# Altium schematic sheet SDC.SchDoc
size A4; DrawnBy: Arvin Dev; SheetNumber: 1; SheetTotal: 1
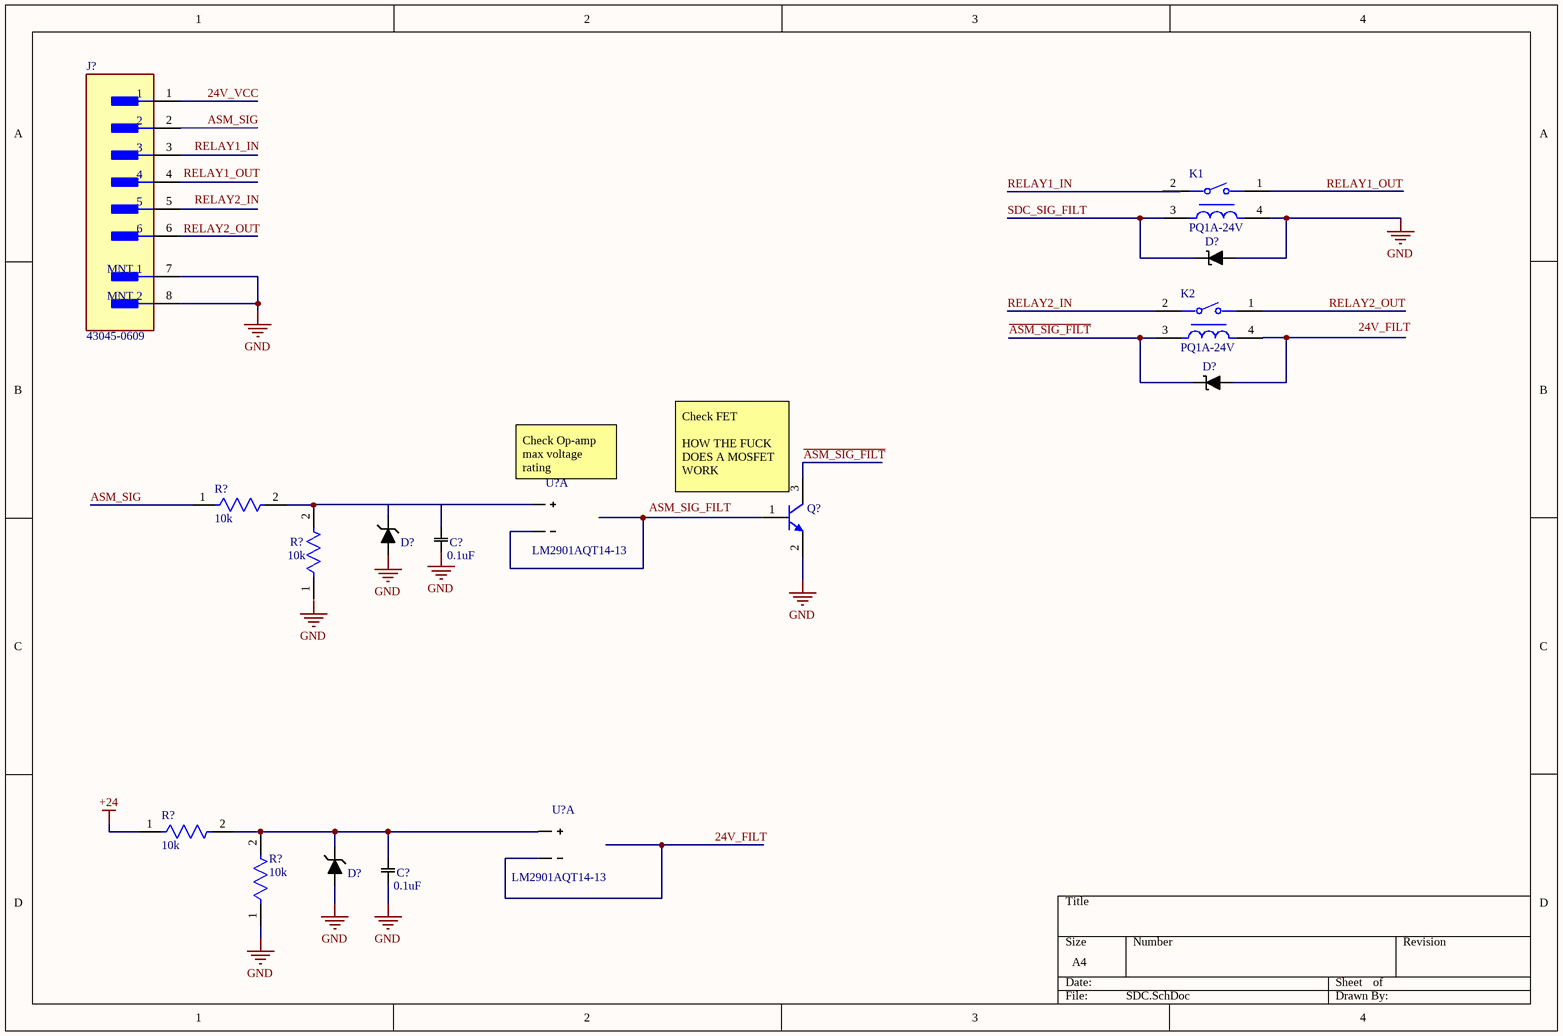
[diagram p0: SDC.SchDoc]

## Parts
(Parts that share a designator on the sheet are numbered #1, #2 ... from top to bottom, then left to right.)
C?#1  value 0.1uF  [CAPC1608X09M]  (hidden comment: CL10B104KB8NNWC)
C?#2  value 0.1uF  [CAPC1608X09M]  (hidden comment: CL10B104KB8NNWC)
D?#1  BAT54LT1G  [SOT95P237X111-3N]  (value not drawn)
D?#2  BAT54LT1G  [SOT95P237X111-3N]  (value not drawn)
D?#3  PZS1116BES_R1_00001  [SODFL160X65-2N]  (value not drawn)
D?#4  PZS1116BES_R1_00001  [SODFL160X65-2N]  (value not drawn)
J?  43045-0609  [FP-43045-0609-MFG]
K1  PQ1A-24V  [FP-PQ1A-24V-MFG]
K2  PQ1A-24V  [FP-PQ1A-24V-MFG]
Q?  BC847B  [INF-SOT23_M]  (value not drawn)
R?#1  10k  [FP-ESR03-MFG]
R?#2  10k  [FP-ESR03-MFG]
R?#3  10k  [FP-ESR03-MFG]
R?#4  10k  [FP-ESR03-MFG]
U?#1  LM2901AQT14-13  [TSOP65P640X120-14N]  (part A of 5)
U?#2  LM2901AQT14-13  [TSOP65P640X120-14N]  (part A of 5)

## Nets
+24: R?#3.1
GND: C?#1.2 C?#2.2 D?#1.1(A) D?#3.2(A) D?#4.2(A) J?.7(MNT_1) J?.8(MNT_2) K1.4 Q?.2(E) R?#4.1
24V_FILT: U?#2.1(OUT1) U?#2.6(IN1-)
24V_VCC: J?.1
~{ASM_SIG_FILT}: D?#2.3(K) K2.3 Q?.3(C)
ASM_SIG: J?.2 R?#1.1
RELAY1_IN: K1.2(COM)
RELAY1_OUT: K1.1(NO)
RELAY2_IN: K2.2(COM)
RELAY2_OUT: J?.6 K2.1(NO)
SDC_SIG_FILT: D?#1.3(K) K1.3
NetC?#1_1: C?#1.1 D?#3.1(K) R?#1.2 R?#2.2 U?#1.7(IN1+)
NetC?#2_1: C?#2.1 D?#4.1(K) R?#3.2 R?#4.2 U?#2.7(IN1+)
NetD?#2_1: D?#2.1(A) K2.4
NetQ?_1: Q?.1(B) U?#1.1(OUT1) U?#1.6(IN1-)

Not connected (* = marked no-connect by the designer): J? 3 4 5; R?#2 1

## Notes on the sheet
- (near U?#1) Check Op-amp max voltage rating
- (near Q?) Check FET
  HOW THE FUCK DOES A MOSFET WORK
- Labels drawn without touching a wire or pin: 24V_FILT, ASM_SIG_FILT, GND, RELAY1_IN, RELAY1_OUT, RELAY2_IN

## Library data of the parts
C?#1 C?#2 = CMP-001-00001-2: CAP CER 0.1UF 50V X7R 0603; Manufacturer: Samsung Electro-Mechanics; SPN: 1276-1935-1-ND; MPN: CL10B104KB8NNWC; Link: https://www.digikey.com.au/en/products/detail/samsung-electro-mechanics/CL10B104KB8NNWC/3887593; Supplier: Digi-Key
D?#1 D?#2 = CMP-00025-2: DIODE SCHOTTKY 30V 200MA SOT23-3; Manufacturer: onsemi; SPN: BAT54LT1GOSCT-ND; Link: https://www.digikey.com.au/en/products/detail/onsemi/BAT54LT1G/918316; Supplier: Digi-Key; MPN: BAT54LT1G
D?#3 D?#4 = CMP-004-00000-1: Zener Diode 16 V 150 mW ±5% Surface Mount SOD-523; Manufacturer: Panjit International Inc.; SPN: 3757-PZS1116BES_R1_00001CT-ND; Link: https://www.digikey.com.au/en/products/detail/panjit-international-inc/PZS1116BES-R1-00001/15800333; MPN: PZS1116BES_R1_00001; Supplier: Digi-Key
J? = CMP-00066-1: Header, 2 Row, Right-Angle, Solder Tab, 6 Pin, Tin Plate, SMT, Glow Wire Compatible; Current Rating: 5A; Glow Wire Compliant: Compliant; Mating Cycles: 30; Pitch: 3mm; Voltage Rating (AC): 250V; Voltage Rating: 600V; Contact Resistance: 10mR; Row Spacing: 0.118inch; Max Voltage Rating (DC): 250.25kV; Gender: Male; Connector Type: Power,Rectangular; Insulation Resistance: 1GR; Number of Circuits: 6; Color: Black; Material: Polymer,Glass,Thermoplastic; Contact Material: Brass,Tin; Fastening Type: Ramp; Contact Gender: Male; Packaging: Tape and Reel; Termination: Solder; Contact Plating: Tin; Min Operating Temperature: -40°C; Halogen Free: Low Halogen; Diameter: 3mm; Reach SVHC Compliant: Unknown; Contact Type: Male Pin; Housing Color: Black; Housing Material: Thermoplastic; RoHS Compliant: Yes; Max Operating Temperature: 105°C; Orientation: Right Angle; Number of Rows: 2; Mounting Technology: Surface Mount,PCB; Flammability Rating: UL94 V-0; Number of Poles: 6; Lead Free: Lead Free; Package Quantity: 10; Number of Positions: 6; Working Voltage: 250V; Number of Contacts: 6; Series: Micro-Fit 3.0™ 43045; Voltage Rating (DC): 250V
K1 K2 = CMP-05606-000034-1: RELAY GEN PURPOSE SPST 5A 24V; Max Voltage Rating (DC): 110V; Max Voltage Rating (AC): 250V; Coil Power: 200mW; Release Time: 10ms; Relay Type: General Purpose; Coil Current: 8.3mA; Coil Resistance: 2.88kR; Coil Type: Non-Latching; Operate Time: 20ms; Contact Material: Silver; Length: 20mm; Voltage Rating (AC): 250V; Number of Pins: 4; RoHS Compliant: Yes; Min Operating Temperature: -40°C; Throw Configuration: SPST; Power Consumption: 200mW; Lead Free: Lead Free; Depth: 10mm; Contact Current Rating: 5A; Package Quantity: 100; Weight: 7g; Mount: Through Hole; Type: Mechanical; Packaging: Bulk; Termination: PC Pin; Radiation Hardening: No; Series: PQ; Max Operating Temperature: 70°C; Max Current Rating: 5A; Coil Voltage (DC): 24V
Q? = CMP-1177-00042-1: NPN Silicon AF Transistor, 45 V VCEO, 100 mA IC, SOT23, Reel, Green; Manufacturer: Infineon; VEBO (max): 6Â V; ICBO (max): 15Â nA; VCBO (max): 50Â V; IBM (max): 200Â mA; Green: TRUE; Ptot (max): 330Â mW; fT (typ): 250Â MHz; IC (max): 100Â mA; VCEO (max): 45Â V; PackageDescription: 3-Pin Small Outline Transistor Package, 1.3 x 2.9 mm Body, 0.95 mm Pitch; ComponentLink3URL: http://www.infineon.com/dgdl/SOT23-Package_Overview.pdf?folderId=db3a30431936bc4b0119532290053c66&fileId=db3a30431936bc4b0119533468123c85; PackageVersion: Apr-08; Packing: Reel; ComponentLink3Description: Package Specification; ComponentLink2URL: http://www.infineon.com/dgdl/bc847series_bc848series_bc849series_bc850series.pdf?folderId=db3a304314dca389011541d30fa21656&fileId=db3a304314dca389011541d4630a1657; ComponentLink1URL: http://www.infineon.com/; ComponentLink2Description: Datasheet; Polarity: NPN; Mounting Technology: Surface Mount; PackageReference: SOT23; ICM (max): 200Â mA; ComponentLink1Description: Manufacturer URL; PartNumber: BC847B
R?#1-R?#4 = CMP-08839-028975-1: 10kΩ ±5% 0.25W 0603 Anti-Surge Chip Resistor AEC-Q200; Resistance: 10kR; Power Rating: 250mW; Temperature Coefficient: 200ppm/°C; Tolerance: 5%; Series: ESR03; Package Quantity: 5000; Length: 0.063inch; Height: 0.022inch; Lead Free: Lead Free; Case/Package: 0603; Case Code (Metric): 1608; Width: 0.031inch; Resistor Type: Thick Film; Max Power Dissipation: 250mW; Packaging: Tape and Reel; Mount: Surface Mount; Number of Terminations: 2; Case Code (Imperial): 0603; Max Operating Temperature: 155°C; Min Operating Temperature: -55°C; RoHS Compliant: Yes
U?#1 U?#2 = CMP-001-0004-3: IC COMP DUAL DIFF 14TSSOP; Manufacturer: Diodes Incorporated; SPN: LM2901AQT14-13DICT-ND; MPN: LM2901AQT14-13; Link: https://www.digikey.com.au/en/products/detail/diodes-incorporated/LM2901AQT14-13/5824479; Supplier: Digi-Key